# Altium schematic sheet wifi.SchDoc
size A4
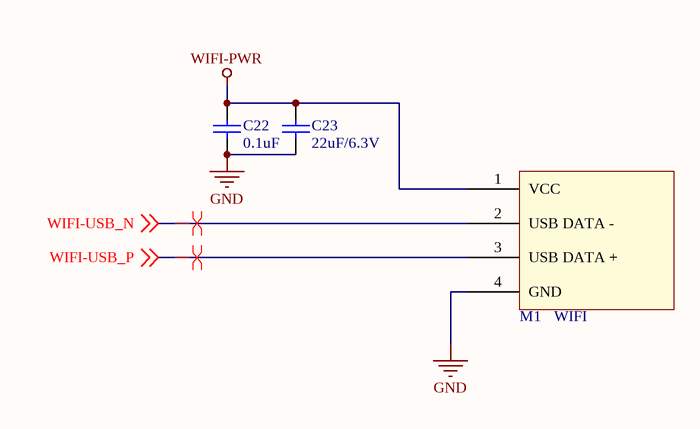
[diagram p0: wifi.SchDoc]

## Parts
C22  0.1uF  [0603]
C23  22uF/6.3V  [0805]
M1  WIFI  [WIFI]

## Nets
GND: C22.2 C23.2 M1.4(GND)
WIFI-PWR: C22.1 C23.1 M1.1(VCC)
WIFI-USB_N: M1.2(USB_DATA_-) ; off-sheet WIFI-USB_N
WIFI-USB_P: M1.3(USB_DATA_+) ; off-sheet WIFI-USB_P

## Layout directives
differential pair: WIFI-USB_N, WIFI-USB_P

## Library data of the parts
C22 C23 = Cap: Capacitor